# Altium schematic sheet Motor Driver (Single).SchDoc
size A4; SheetNumber: 8; SheetTotal: 8
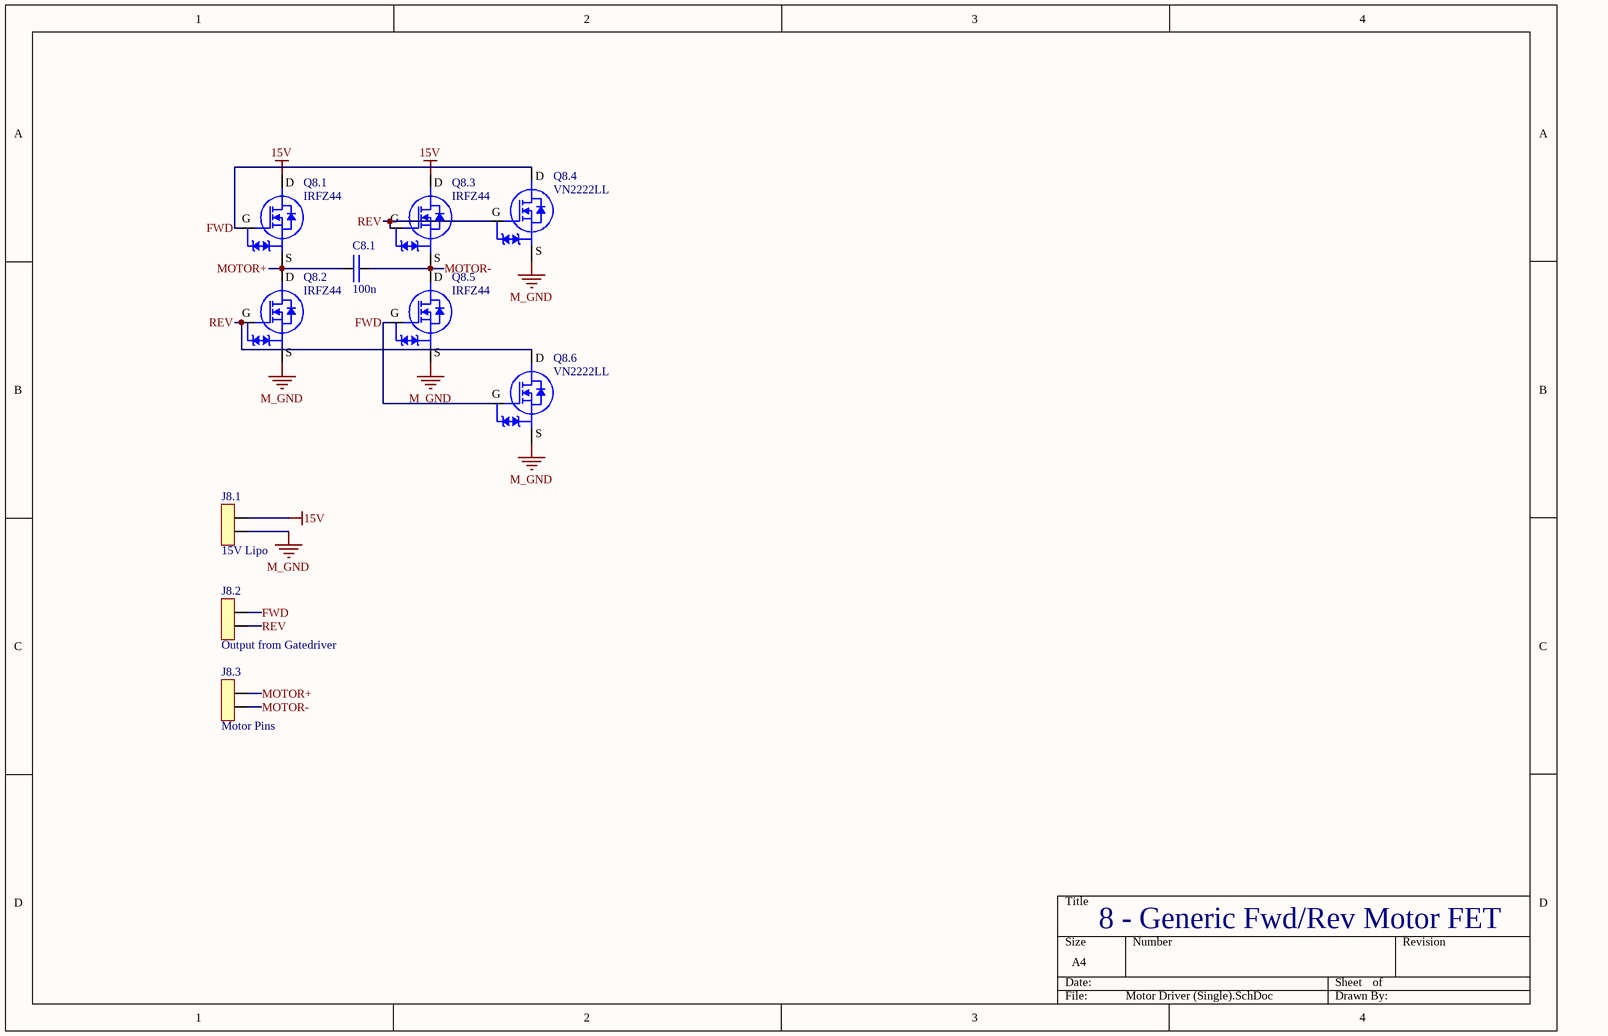
[diagram p0: Motor Driver (Single).SchDoc]

## Parts
C8.1  100n  [Non Polarized Cap]
J8.1  15V Lipo  [2pos JST]
J8.2  Output from Gatedriver  [2pos JST]
J8.3  Motor Pins  [2pos JST]
Q8.1  IRFZ44  [TO220]
Q8.2  IRFZ44  [TO220]
Q8.3  IRFZ44  [TO220]
Q8.4  VN2222LL  [VN2222LL]
Q8.5  IRFZ44  [TO220]
Q8.6  VN2222LL  [VN2222LL]

## Nets
15V: J8.1.2 Q8.1.2(D) Q8.3.2(D)
M_GND: J8.1.1 Q8.2.3(S) Q8.4.1(S) Q8.5.3(S) Q8.6.1(S)
FWD: J8.2.2 Q8.1.1(G) Q8.4.3(D) Q8.5.1(G) Q8.6.2(G)
MOTOR+: C8.1.1 J8.3.2 Q8.1.3(S) Q8.2.2(D)
MOTOR-: C8.1.2 J8.3.1 Q8.3.3(S) Q8.5.2(D)
REV: J8.2.1 Q8.2.1(G) Q8.3.1(G) Q8.4.2(G) Q8.6.3(D)

## Notes on the sheet
- 8 - Generic Fwd/Rev Motor FET

## Library data of the parts
C8.1 = Cap_Generic
J8.1 = 2pos Conn: 2pos Conn JST
J8.2 J8.3 = 2pos Conn
Q8.1-Q8.3 Q8.5 = IRFZ44 NMOS: IRFZ44EPBF N-Channel 60 V 48A 110W Through Hole TO-220AB; Supplier 1: Digi-Key; Supplier Part Number 1: IRFZ44ZLPBF-ND
Q8.4 Q8.6 = VN2222LL NMOS: VN2222LL N-Channel 60 V 150mA 400mW Through Hole TO-92 (TO-226); Supplier 1: Mouser; Supplier Part Number 1: 689-VN2222LL-G